# EAGLE design ui (EAGLE 8.4.3)
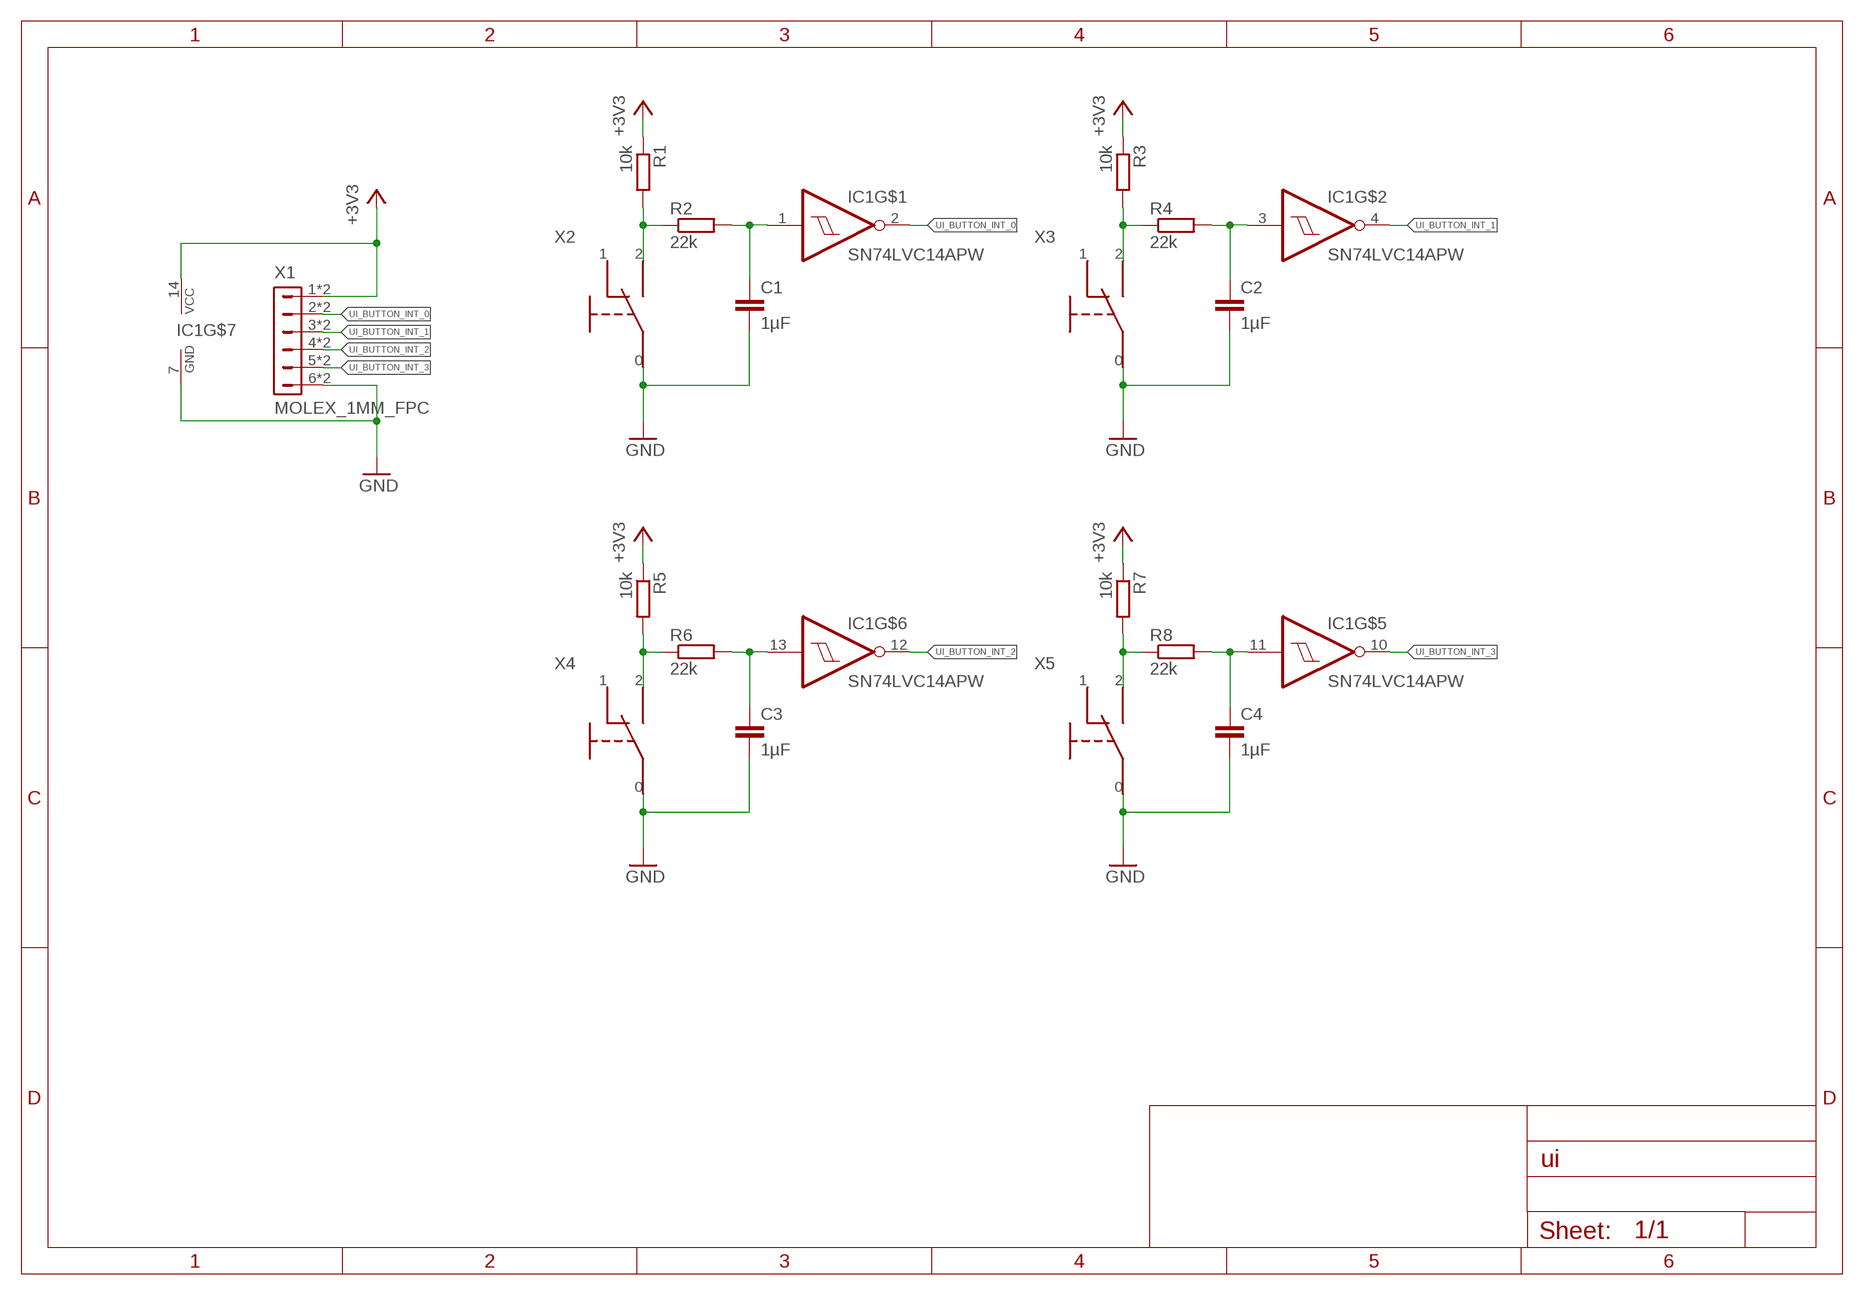
[diagram p0: schematic, sheet 1]

## Parts
C1  1µF  C-EUC0805  [C0805]
C2  1µF  C-EUC0805  [C0805]
C3  1µF  C-EUC0805  [C0805]
C4  1µF  C-EUC0805  [C0805]
IC1  SN74LVC14APW  [TSSOP14]
R1  10k  R-EU_R0805  [R0805]
R2  22k  R-EU_R0805  [R0805]
R3  10k  R-EU_R0805  [R0805]
R4  22k  R-EU_R0805  [R0805]
R5  10k  R-EU_R0805  [R0805]
R6  22k  R-EU_R0805  [R0805]
R7  10k  R-EU_R0805  [R0805]
R8  22k  R-EU_R0805  [R0805]
X1  MOLEX_1MM_FPC  [1MM_FPC_ZIF]
X2  PVA2OAH11.7NV2  [BUTTON-2]
X3  PVA2OAH11.7NV2  [BUTTON-2]
X4  PVA2OAH11.7NV2  [BUTTON-2]
X5  PVA2OAH11.7NV2  [BUTTON-2]

## Nets
+3V3: IC1.14(VCC) R1.1 R3.1 R5.1 R7.1 X1.1 X1.7
GND: C1.2 C2.2 C3.2 C4.2 IC1.7(GND) X1.6 X1.12 X2.0 X3.0 X4.0 X5.0
N$1: R1.2 R2.1 X2.2
N$2: C1.1 IC1.1(I) R2.2
N$3: R3.2 R4.1 X3.2
N$9: C2.1 IC1.3(I) R4.2
N$10: R5.2 R6.1 X4.2
N$11: C3.1 IC1.13(I) R6.2
N$12: R7.2 R8.1 X5.2
N$13: C4.1 IC1.11(I) R8.2
UI_BUTTON_INT_0: IC1.2(O) X1.2 X1.8
UI_BUTTON_INT_1: IC1.4(O) X1.3 X1.9
UI_BUTTON_INT_2: IC1.12(O) X1.4 X1.10
UI_BUTTON_INT_3: IC1.10(O) X1.5 X1.11
Unconnected: IC1.5(I) IC1.6(O) IC1.8(O) IC1.9(I) X2.1 X3.1 X4.1 X5.1

## Library data of the parts
C1-C4 = rcl:C-EU: CAPACITOR, European symbol; OC_MOUSER: 80-C0805C105M3R
IC1 = thermo:SN74LVC14APW; OC_MOUSER: 595-SN74LVC14APWR
R1 R3 R5 R7 = rcl:R-EU_: RESISTOR, European symbol; OC_MOUSER: 603-RC0805FR-0710KL
R2 R4 R6 R8 = rcl:R-EU_: RESISTOR, European symbol; OC_MOUSER: 603-RC0805FR-0722KL
X1 = thermo:MOLEX_1MM_FPC; OC_MOUSER: 538-52610-0672
X2-X5 = thermo:PVA2OAH11.7NV2; OC_MOUSER: PVA2OAH11.7NV2

## Board
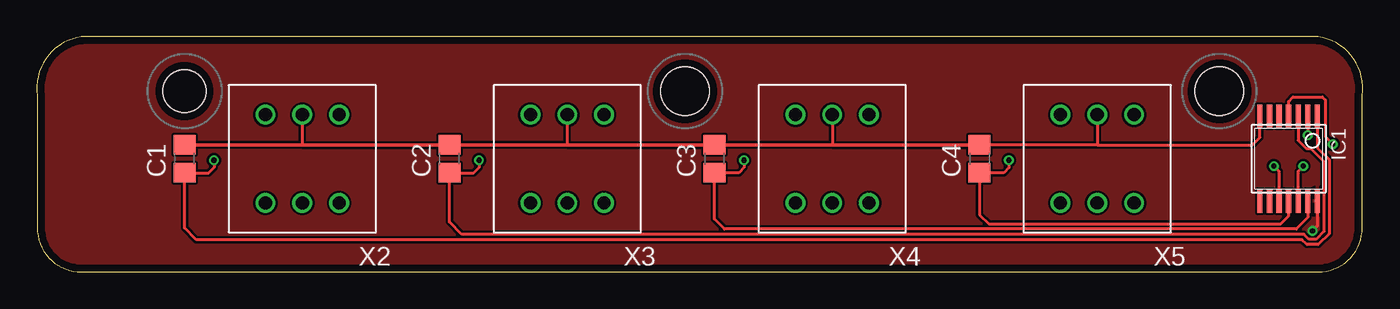
[diagram p1: board, top side]
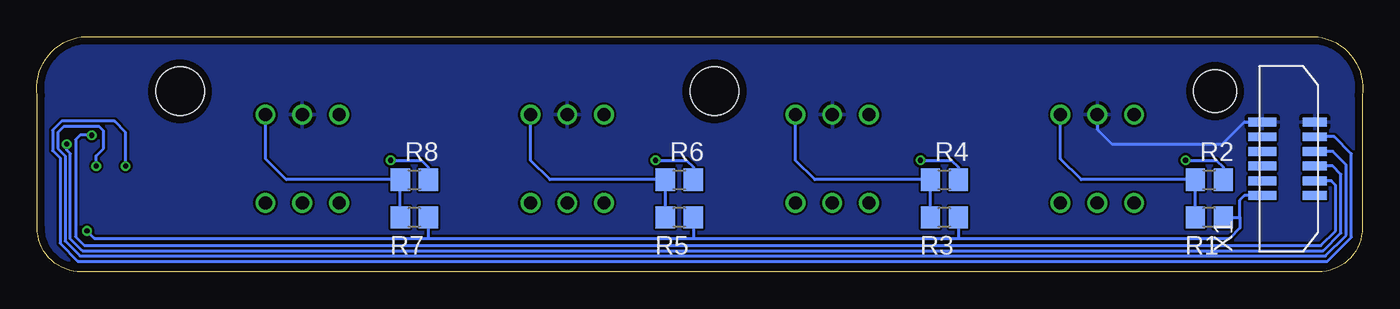
[diagram p2: board, bottom side, seen from below]

Size 90.06 x 16 mm. Coordinates in mm from the lower left corner, seen from the top.
Outline: 90.03,3 90.03,12 arc90 87.03,16 3.03,16 arc90 0.03,12 0.03,3 arc90 3.03,0 87.03,0 arc90 90.03,3
Copper layers (1*16): Top 0.035mm / dielectric 1.6mm / Bottom 0.035mm
Design rules "Elecrow_2-layer_PCB_eagle_rule": minimum track width 6mil, minimum drill 12mil, track to track 6mil, track to pad 6mil, pad to pad 6mil, via to via 8mil, smd to smd 0mil, copper to edge 20mil, drill to drill 10mil, minimum pad ring 6mil, minimum via ring 6mil, stop-mask expansion 0mil, vias tented up to drill 100mil, thermal gap 10mil
Holes 3.3 mm at 80.33,12.3 44.03,12.3
Holes 2.9 mm at 10.03,12.3

### Footprints (pad centres in the part's own frame; a part is rotated, then mirrored left to right if it is on the bottom)
C0805 = smd 1.3 x 1.5: 1 -0.95,0; 2 0.95,0
TSSOP14 = smd 0.35 x 1.6: 1 -1.95,-2.875; 2 -1.3,-2.875; 3 -0.65,-2.875; 4 0,-2.875; 5 0.65,-2.875; 6 1.3,-2.875; 7 1.95,-2.875; 8 1.95,2.875; 9 1.3,2.875; 10 0.65,2.875; 11 0,2.875; 12 -0.65,2.875; 13 -1.3,2.875; 14 -1.95,2.875
R0805 = smd 1.3 x 1.5: 1 -0.95,0; 2 0.95,0
1MM_FPC_ZIF = smd 0.6 x 1.9: 1 -2.5,1.775; 2 -1.5,1.775; 3 -0.5,1.775; 4 0.5,1.775; 5 1.5,1.775; 6 2.5,1.775 | smd 0.6 x 1.65: 7 -2.5,-1.775; 8 -1.5,-1.775; 9 -0.5,-1.775; 10 0.5,-1.775; 11 1.5,-1.775; 12 2.5,-1.775
BUTTON-2 = drill 0.9: 0 0,-3; 0' 0,3; 1 2.5,-3; 1' 2.5,3; 2 -2.5,-3; 2' -2.5,3

### Placement (x,y rotation side)
C1  10.03,7.7 90 top
C2  28.03,7.7 90 top
C3  46.03,7.7 90 top
C4  64.03,7.7 90 top
IC1  85.03,7.7 180 top
R1  10.42,3.72 180 bottom
R2  10.42,6.28 0 bottom
R3  28.42,3.72 180 bottom
R4  28.42,6.28 0 bottom
R5  46.42,3.72 180 bottom
R6  46.42,6.28 0 bottom
R7  64.42,3.72 180 bottom
R8  64.42,6.28 0 bottom
X1  5.03,7.7 90 bottom
X2  18.03,7.7 180 top
X3  36.03,7.7 180 top
X4  54.03,7.7 180 top
X5  72.03,7.7 180 top

### Tracks (layer width: path | path; a pad name or v marks a point on that pad's centre or on a via)
+3V3  (via drill 0.35)
  Top 0.2: IC1.14 86.98,3.12 v86.66,2.8
  Bottom 0.2: X1.1 8.03,5.2 8.33,4.9 8.33,3.72 | 8.33,3.72 8.33,3 9.03,2.3 27.43,2.3 | R1.1 8.33,3.72 | 45.43,2.3 27.43,2.3 | 63.53,2.3 45.43,2.3 | R3.1 27.47,2.34 27.43,2.3 | R5.1 45.47,2.34 45.43,2.3 | R7.1 63.47,2.36 63.53,2.3 | v86.66,2.8 86.16,2.3 63.53,2.3
  pour Top (isolate 0.152): -1.97,18 93.03,18 93.03,-1 -1.97,-1
GND
  Top 0.2: X3.0 36.03,8.65 | X2.0 18.03,8.65 | X4.0 54.03,8.65 | IC1.7 83.08,9.15 82.58,8.65 72.03,8.65 | 72.03,8.65 C4.2 | X5.0 72.03,8.65
  Top 0.254: C1.2 18.03,8.65 C2.2 36.03,8.65 C3.2 54.03,8.65 C4.2
  Bottom 0.2: X2.0 18.03,9.7 17.03,8.7 9.53,8.7 8.03,10.2 X1.6
  pour Bottom (isolate 0.152): -0.97,17 92.03,17 92.03,0 -0.97,0
N$1
  Bottom 0.2: R1.2 R2.1 19.11,6.28 20.53,7.7 X2.2
N$2  (via drill 0.35)
  Top 0.2: v12.03,7.6 12.03,7.1 11.68,6.75 C1.1 10.03,3 10.83,2.2 85.94,2.2 86.27,1.87 87.04,1.87 87.78,2.61 87.78,7.65 86.98,8.45 IC1.1
  Bottom 0.2: R2.2 9.47,7.14 9.93,7.6 v12.03,7.6
N$3
  Bottom 0.2: R3.2 R4.1 37.21,6.28 38.53,7.6 X3.2
N$9  (via drill 0.35)
  Top 0.2: v30.03,7.6 30.03,7.1 29.68,6.75 C2.1 28.03,3.4 28.86,2.57 86.07,2.57 86.42,2.22 86.9,2.22 87.43,2.75 87.43,7.5 86.53,8.4 86.23,8.4 85.68,8.95 IC1.3
  Bottom 0.2: R4.2 27.47,7.14 27.93,7.6 v30.03,7.6
N$10
  Bottom 0.2: R5.2 R6.1 55.21,6.28 56.53,7.6 X4.2
N$11  (via drill 0.35)
  Top 0.2: IC1.13 86.33,3.7 85.56,2.92 46.71,2.92 46.03,3.6 C3.1 47.68,6.75 48.03,7.1 v48.03,7.6
  Bottom 0.2: R6.2 45.47,7.14 45.93,7.6 v48.03,7.6
N$12
  Bottom 0.2: R7.2 R8.1 73.11,6.28 74.53,7.7 X5.2
N$13  (via drill 0.35)
  Top 0.2: IC1.11 85.03,3.8 84.51,3.27 64.66,3.27 64.03,3.9 C4.1 65.68,6.75 66.03,7.1 v66.03,7.6
  Bottom 0.2: R8.2 63.47,7.14 63.93,7.6 v66.03,7.6
UI_BUTTON_INT_0  (via drill 0.35)
  Top 0.2: IC1.2 v86.33,9.3
  Bottom 0.2: X1.8 2.13,6.2 1.83,5.9 1.83,2.8 2.83,1.8 86.83,1.8 87.43,2.4 87.43,9 87.13,9.3 v86.33,9.3
UI_BUTTON_INT_1  (via drill 0.35)
  Top 0.2: IC1.4 85.03,11.6 85.33,11.9 87.33,11.9 87.53,11.7 87.53,9.2 v88.03,8.7
  Bottom 0.2: v88.03,8.7 88.03,8.3 87.78,8.05 87.78,2.25 86.98,1.45 2.69,1.45 1.48,2.65 1.48,6.65 2.03,7.2 X1.9
UI_BUTTON_INT_2  (via drill 0.35)
  Top 0.2: IC1.12 85.68,6.85 v86.03,7.2
  Bottom 0.2: X1.10 2.03,8.2 1.13,7.29 1.13,2.51 2.54,1.09 87.12,1.09 88.14,2.11 88.14,7.91 | v86.03,7.2 86.03,7.9 85.53,8.4 85.53,9.6 85.83,9.9 88.23,9.9 88.63,9.5 88.63,8.4 88.14,7.91 | 88.14,7.91
UI_BUTTON_INT_3  (via drill 0.35)
  Top 0.2: IC1.10 84.38,6.85 v84.03,7.2
  Bottom 0.2: v84.03,7.2 84.03,9.5 84.78,10.25 88.38,10.25 88.98,9.65 88.98,8.25 88.49,7.76 88.49,1.96 87.27,0.74 2.39,0.74 0.78,2.36 0.78,8.04 1.93,9.2 X1.11